# Altium schematic sheet PowerSupply.SchDoc
size A4; SheetNumber: 2; SheetTotal: 9
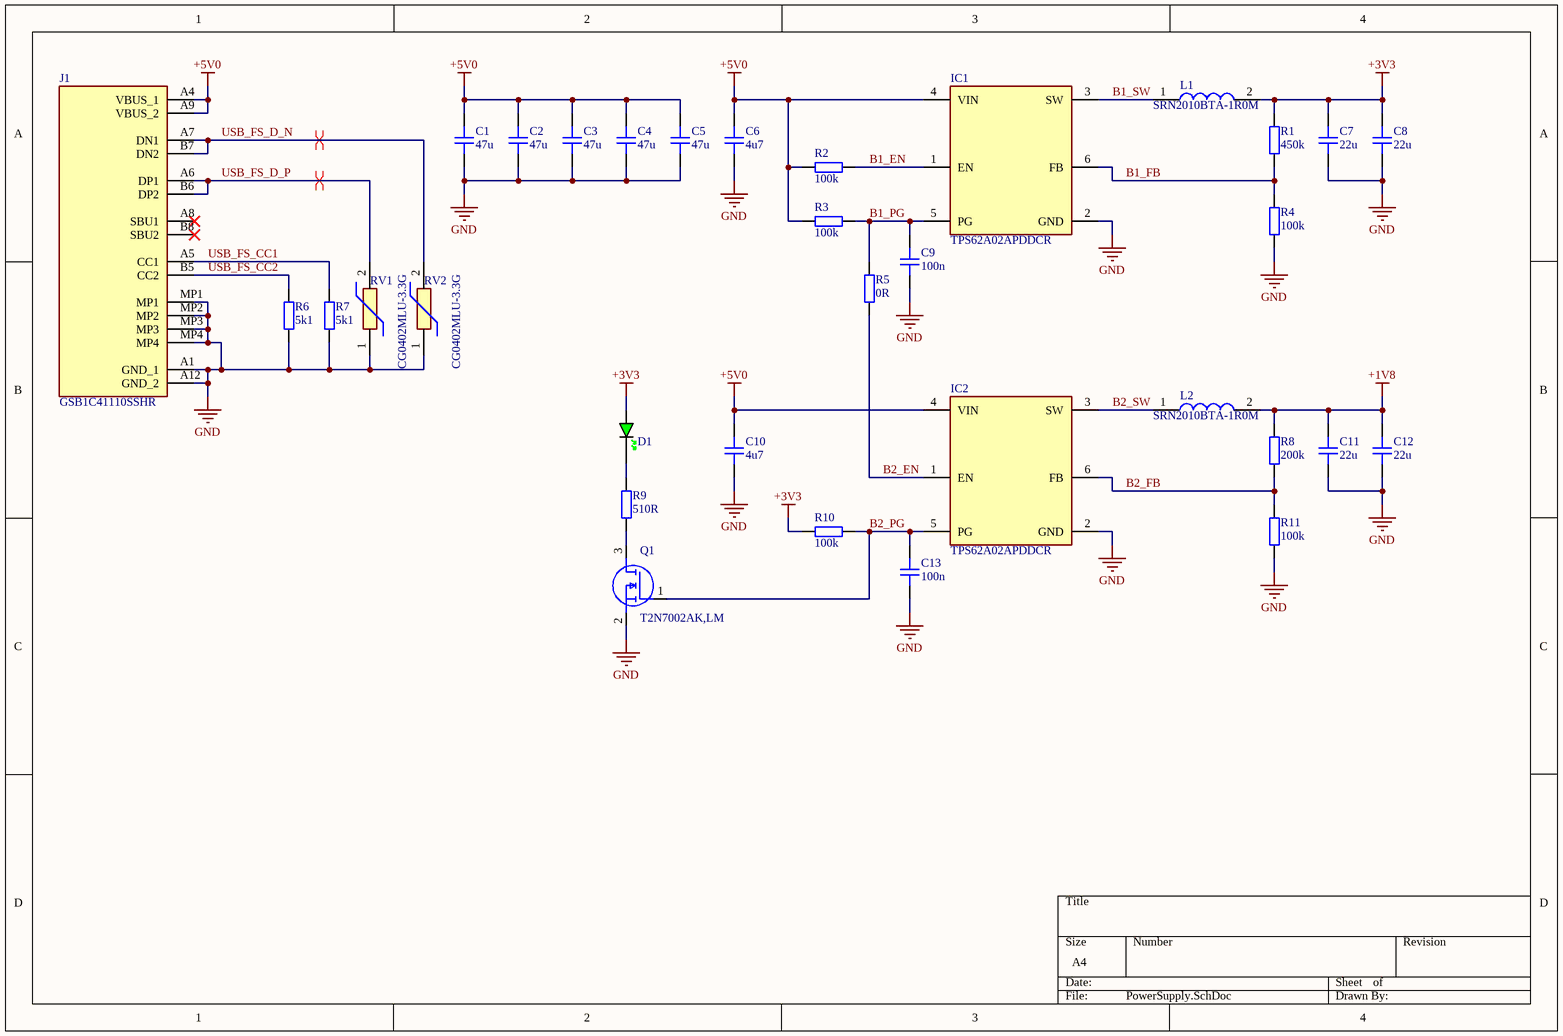
[diagram p0: PowerSupply.SchDoc]

## Parts
C1  47u  [CAP_1210]
C2  47u  [CAP_1210]
C3  47u  [CAP_1210]
C4  47u  [CAP_1210]
C5  47u  [CAP_1210]
C6  4u7  [CAP_0603]
C7  22u  [CAP_0603]
C8  22u  [CAP_0603]
C9  100n  [CAP_0402]
C10  4u7  [CAP_0603]
C11  22u  [CAP_0603]
C12  22u  [CAP_0603]
C13  100n  [CAP_0402]
D1  GREEN  [LED_0603_GREEN]  (value not drawn)
IC1  TPS62A02APDDCR  [SOT95P280X110-6N - duplicate]
IC2  TPS62A02APDDCR  [SOT95P280X110-6N - duplicate]
J1  GSB1C41110SSHR  [GSB1C41110SSHR]
L1  SRN2010BTA-1R0M  [SRN2010BTA1R0M]
L2  SRN2010BTA-1R0M  [SRN2010BTA1R0M]
Q1  T2N7002AK,LM  [TBAT54CLM]
R1  450k  [RES_0402]
R2  100k  [RES_0402]
R3  100k  [RES_0402]
R4  100k  [RES_0402]
R5  0R  [RES_0402]
R6  5k1  [RES_0402]
R7  5k1  [RES_0402]
R8  200k  [RES_0402]
R9  510R  [RES_0603]
R10  100k  [RES_0402]
R11  100k  [RES_0402]
RV1  CG0402MLU-3.3G  [VARC1005X41N]
RV2  CG0402MLU-3.3G  [VARC1005X41N]

## Nets
+1V8: C11.2 C12.2 L2.2 R8.2
+3V3: C7.2 C8.2 D1.A L1.2 R1.2 R10.1
+5V0: C1.2 C2.2 C3.2 C4.2 C5.2 C6.2 C10.2 IC1.4(VIN) IC2.4(VIN) J1.A4(VBUS_1) J1.A9(VBUS_2) R2.1 R3.1
GND: C1.1 C2.1 C3.1 C4.1 C5.1 C6.1 C7.1 C8.1 C9.1 C10.1 C11.1 C12.1 C13.1 IC1.2(GND) IC2.2(GND) J1.A1(GND_1) J1.A12(GND_2) J1.MP1 J1.MP2 J1.MP3 J1.MP4 Q1.2(S) R4.1 R6.2 R7.2 R11.1 RV1.1 RV2.1
B1_EN: IC1.1(EN) R2.2
B1_FB: IC1.6(FB) R1.1 R4.2
B1_PG: C9.2 IC1.5(PG) R3.2 R5.2
B1_SW: IC1.3(SW) L1.1
B2_EN: IC2.1(EN) R5.1
B2_FB: IC2.6(FB) R8.1 R11.2
B2_PG: C13.2 IC2.5(PG) Q1.1(G) R10.2
B2_SW: IC2.3(SW) L2.1
USB_FS_CC1: J1.A5(CC1) R7.1
USB_FS_CC2: J1.B5(CC2) R6.1
USB_FS_D_N: J1.A7(DN1) J1.B7(DN2) RV2.2
USB_FS_D_P: J1.A6(DP1) J1.B6(DP2) RV1.2
NetD1_K: D1.K R9.2
NetQ1_3: Q1.3(D) R9.1

Not connected (* = marked no-connect by the designer): J1 A8(SBU1)* B8(SBU2)*

## Layout directives
differential pair: USB_FS_D_N, USB_FS_D_P

## Library data of the parts
C1-C5 = CAP_1210: Capacitor SMD 1210; Manufacturer: *; Manufacturer Part Number: *; Distributor Link: *; LCSC: *; Rating: *; Dielectric: *
C6-C8 C10-C12 = CAP_0603: Capacitor SMD 0603; Manufacturer: *; Manufacturer Part Number: *; Distributor Link: *; LCSC: *; Rating: *; Dielectric: *
C9 C13 = CAP_0402: Capacitor SMD 0402; Manufacturer: *; Manufacturer Part Number: *; Distributor Link: *; LCSC: *; Rating: *; Dielectric: *
D1 = LED_0603_GREEN: LED 0603 GREEN SMD
IC1 IC2 = TPS62A02APDDCR: Integrated Circuit; Manufacturer_Name: Texas Instruments; Datasheet Link: https://www.ti.com/lit/ds/symlink/tps62a02a.pdf?ts=1731815729746&ref_url=https%253A%252F%252Fwww.ti.com%252Fproduct%252FTPS62A02A%252Fpart-details%252FTPS62A02APDDCR%253Futm_source%253Dgoogle%2526utm_medium%253Dcpc%2526utm_campaign%253Docb-tistore-null-ap; Height: 1.1mm; Manufacturer_Part_Number: TPS62A02APDDCR; Mouser Part Number: 595-TPS62A02APDDCR; Mouser Price/Stock: https://www.mouser.co.uk/ProductDetail/Texas-Instruments/TPS62A02APDDCR?qs=ZcfC38r4PotJY8Nb5BNo3Q%3D%3D; Arrow Part Number: TPS62A02APDDCR; Arrow Price/Stock: https://www.arrow.com/en/products/tps62a02apddcr/texas-instruments?utm_currency=USD&region=nac
J1 = GSB1C41110SSHR: Connector; Manufacturer_Name: Amphenol Communications Solutions; Datasheet Link: https://cdn.amphenol-cs.com/media/wysiwyg/files/drawing/gsb1c41x10sshr-ax1.pdf; Height: 3.41mm; Manufacturer_Part_Number: GSB1C41110SSHR
L1 L2 = SRN2010BTA-1R0M: Inductor; Manufacturer_Name: Bourns; Datasheet Link: https://www.bourns.com/docs/Product-Datasheets/SRN2010BTA.pdf; Height: 1mm; Manufacturer_Part_Number: SRN2010BTA-1R0M
Q1 = T2N7002AK,LM: MOSFET (N-Channel); Manufacturer_Name: Toshiba; Datasheet Link: http://toshiba.semicon-storage.com/info/docget.jsp?did=29712&prodName=T2N7002AK; Height: 1.1mm; Manufacturer_Part_Number: T2N7002AK,LM; Mouser Part Number: 757-T2N7002AKLM; Mouser Price/Stock: https://www.mouser.co.uk/ProductDetail/Toshiba/T2N7002AKLM?qs=pzVvXTvk9PzfX4hYglwZ9Q%3D%3D; Arrow Part Number: T2N7002AK,LM; Arrow Price/Stock: https://www.arrow.com/en/products/t2n7002aklm/toshiba?region=nac
R1-R8 R10 R11 = RES_0402: Resistor SMD 0402; Manufacturer: *; Manufacturer Part Number: *; Distributor Link: *; LCSC: *
R9 = RES_0603: Resistor SMD 0603; Manufacturer: *; Manufacturer Part Number: *; Distributor Link: *; LCSC: *
RV1 RV2 = CG0402MLU-3.3G: ESD Diode; Manufacturer_Name: Bourns; Datasheet Link: https://www.bourns.com/docs/Product-Datasheets/MLU.pdf; Height: 0.41mm; Manufacturer_Part_Number: CG0402MLU-3.3G; Mouser Part Number: 652-CG0402MLU-3.3G; Mouser Price/Stock: https://www.mouser.co.uk/ProductDetail/Bourns/CG0402MLU-3.3G?qs=m8myXnDJXpWVM8EQWErxtQ%3D%3D; Arrow Part Number: CG0402MLU-3.3G; Arrow Price/Stock: https://www.arrow.com/en/products/cg0402mlu-3.3g/bourns?utm_currency=USD&region=nac